# EasyEDA Pro project Access Control Passive Splitter.eprj

# Schematic Schematic1
Board Name: Board1; Create Date: 2026-01-26; Page Name: P1; Project Name: Access Control Passive Splitter; Schematic Name: Schematic1; Update Date: 2026-01-26; Company: EasyEDA.com; Page Size: A4; Version: V1.0
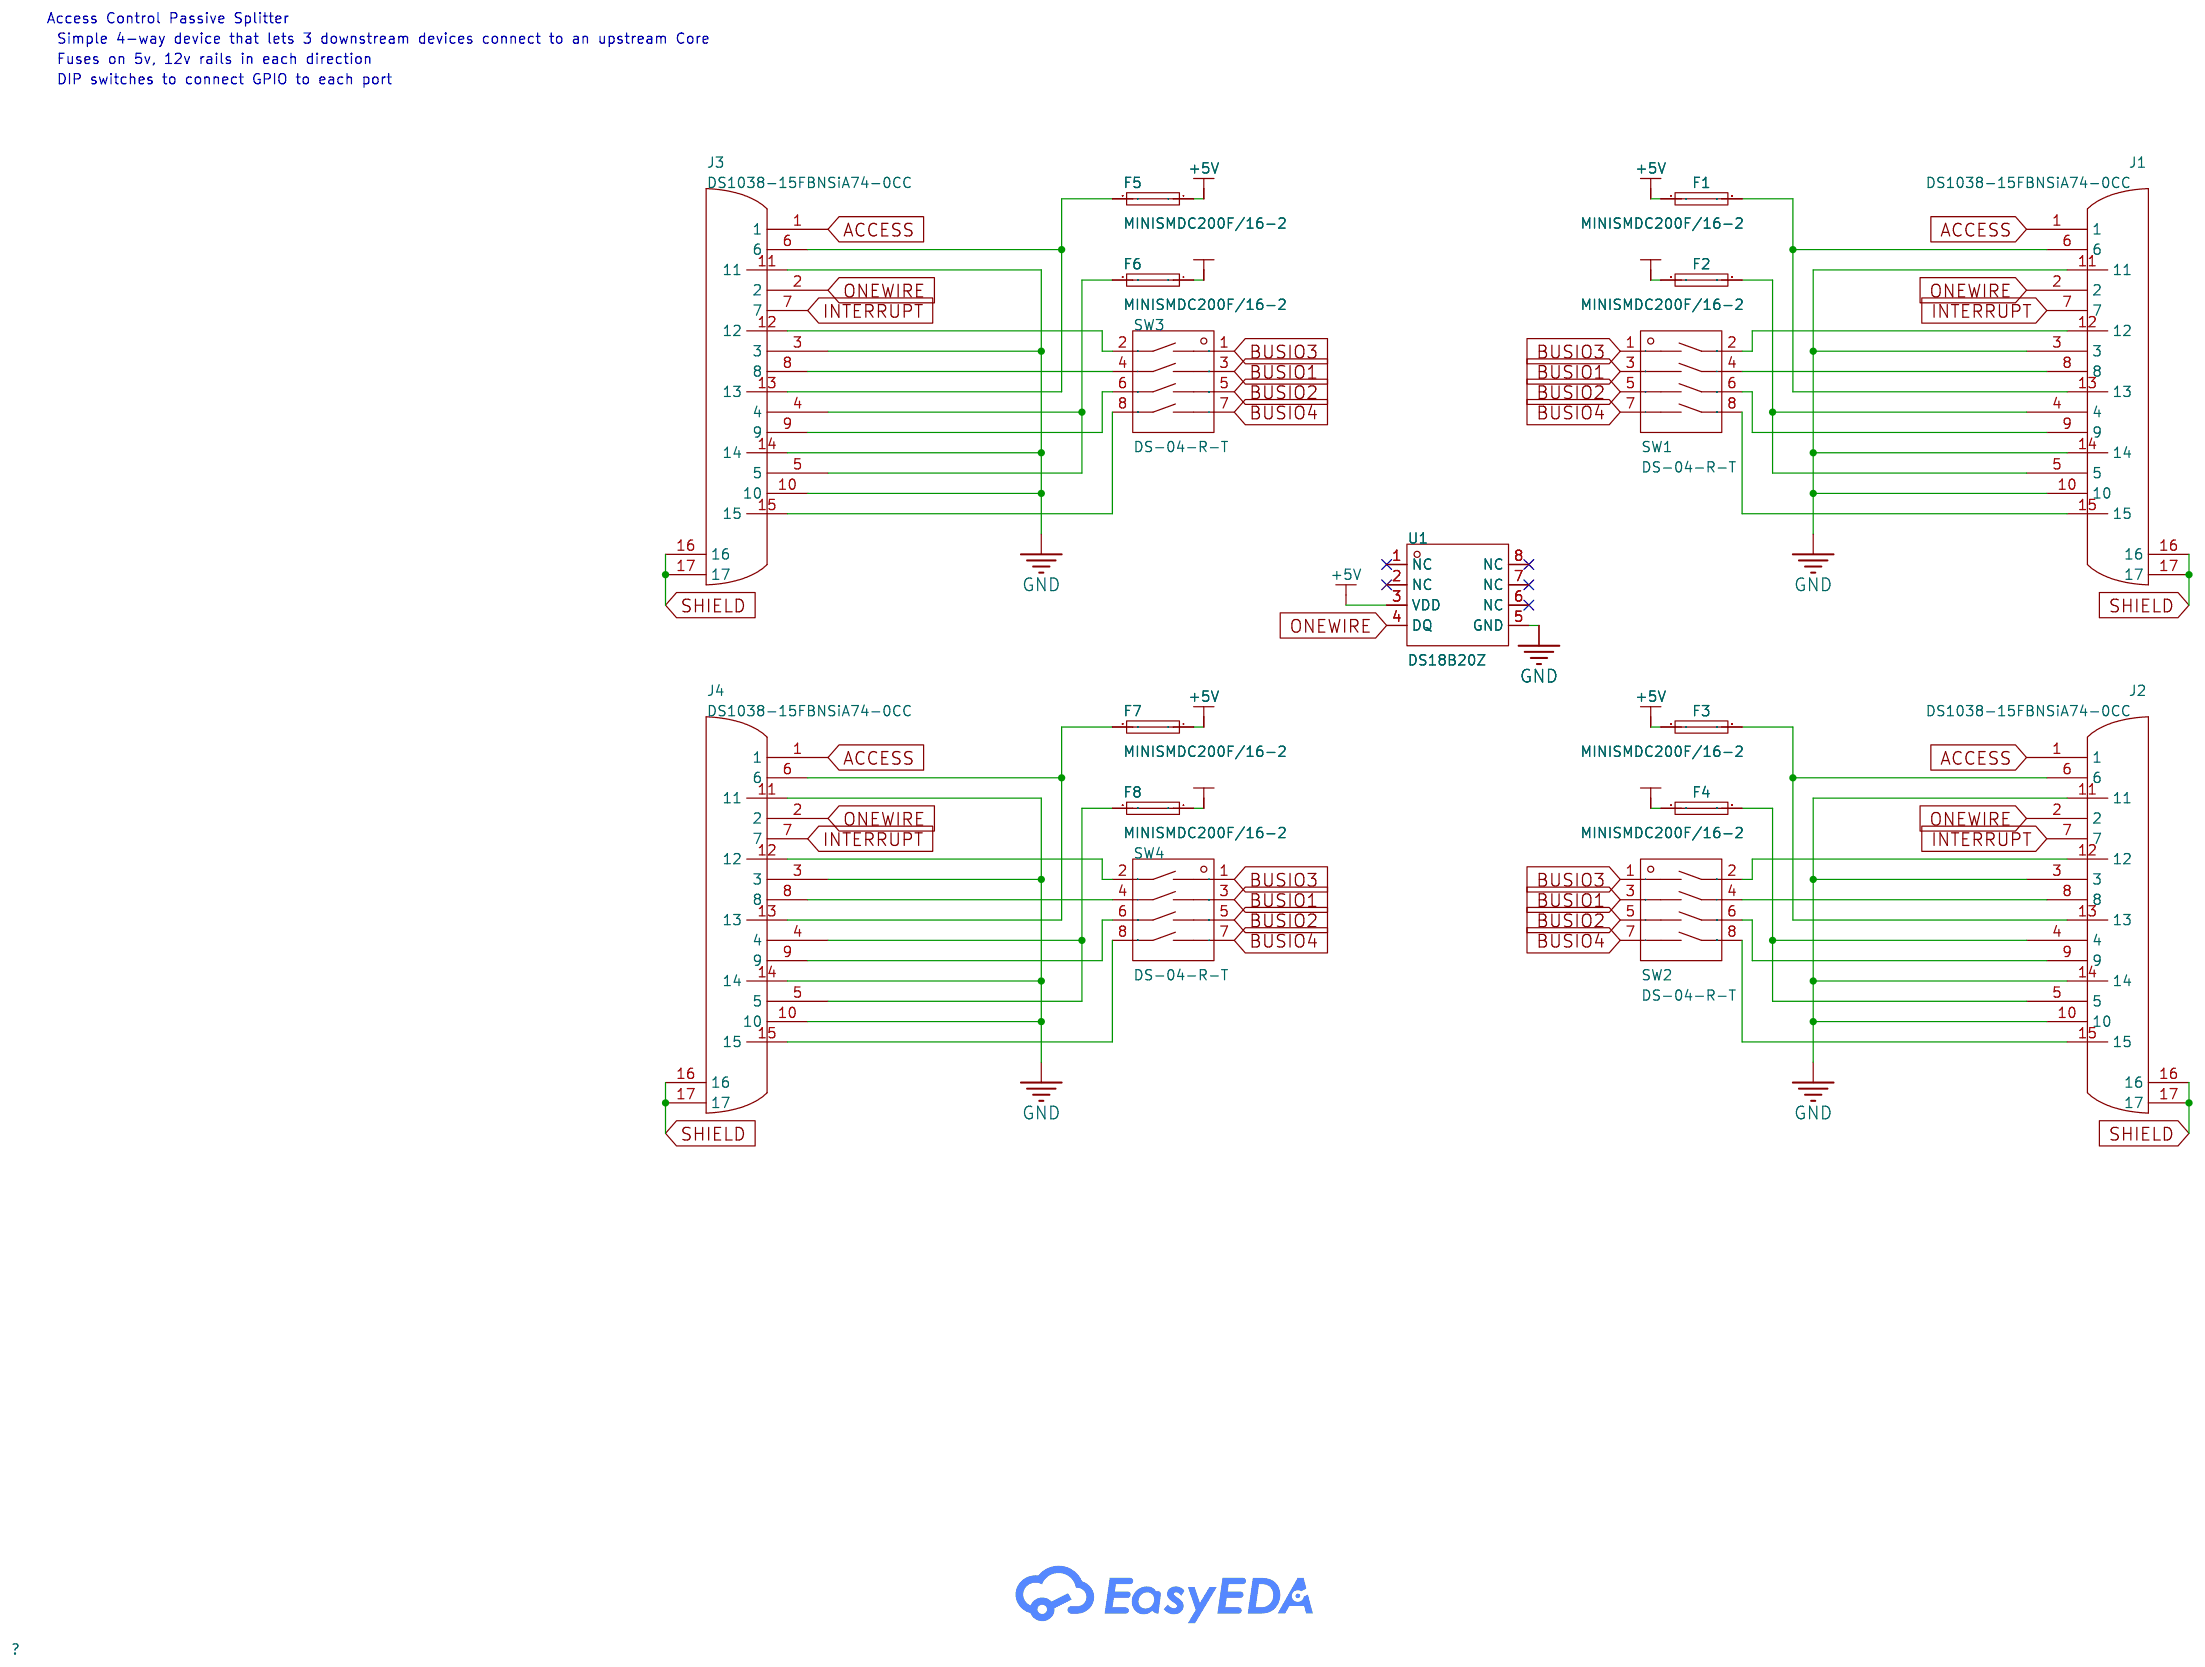
[diagram p0: schematic sheet]

## Parts
F1  MINISMDC200F/16-2  [R1812]
F2  MINISMDC200F/16-2  [R1812]
F3  MINISMDC200F/16-2  [R1812]
F4  MINISMDC200F/16-2  [R1812]
F5  MINISMDC200F/16-2  [R1812]
F6  MINISMDC200F/16-2  [R1812]
F7  MINISMDC200F/16-2  [R1812]
F8  MINISMDC200F/16-2  [R1812]
J1  DS1038-15FBNSiA74-0CC  [DSUB-TH_DS1038-15FBNSIA74-0CC]
J2  DS1038-15FBNSiA74-0CC  [DSUB-TH_DS1038-15FBNSIA74-0CC]
J3  DS1038-15FBNSiA74-0CC  [DSUB-TH_DS1038-15FBNSIA74-0CC]
J4  DS1038-15FBNSiA74-0CC  [DSUB-TH_DS1038-15FBNSIA74-0CC]
SW1  DS-04-R-T  [SW-TH_8P-L11.6-W9.9-P2.54_WT11-DS-04RR]
SW2  DS-04-R-T  [SW-TH_8P-L11.6-W9.9-P2.54_WT11-DS-04RR]
SW3  DS-04-R-T  [SW-TH_8P-L11.6-W9.9-P2.54_WT11-DS-04RR]
SW4  DS-04-R-T  [SW-TH_8P-L11.6-W9.9-P2.54_WT11-DS-04RR]
U1  DS18B20Z  [SOP-8_L4.9-W3.9-P1.27-LS6.0-BL]

## Library data of the parts
F1-F8 = MINISMDC200F/16-2: LCSC Part Name: 16V 2A; Supplier Part: C315963; Manufacturer: Littelfuse(美国力特); Supplier Footprint: 1812; Datasheet: https://item.szlcsc.com/datasheet/MINISMDC200F%252F16-2/297598.html; Supplier: LCSC; Voltage - Max: 16V; Hold Current: 2A; Power Dissipation: 1W; Resistance - Initial (Ri) (Min): 20mΩ; Resistance - Post Trip (R1) (Max): 72mΩ; Operating Temperature: -40℃~+85℃; Length: 5.4mm; Width: 3.2mm
J1-J4 = DS1038-15FBNSiA74-0CC: Connector Type:High Density D-Sub Gender:Female Number of Pins:15P Mounting Type:Right Angle Number of Rows:3 Current Rating-Signal:3A Current Rating-Power:- Voltage Rating:- Color:Black Operating Temperature:-40℃~+105℃ Operating Temperature:-40℃~+105℃; LCSC Part Name: 黑色 1000/盒 D-Sub 母 P数:15P; Supplier Part: C75754; Manufacturer: CONNFLY; Supplier Footprint: 弯插; JLCPCB Part Class: Extended Part; Datasheet: https://item.szlcsc.com/datasheet/DS1038-15FBNSiA74-0CC/76880.html; Supplier: LCSC; Connector Type: High Density D-Sub; Gender: Female; Number of Pins: 15P; Mounting Type: Right Angle; Number of Rows: 3; Current Rating-Signal: 3A; Color: Black; Operating Temperature: -40℃~+105℃
SW1-SW4 = DS-04-R-T: LCSC Part Name: 4位 2.54mm间距 宽体 拨码开关; Supplier Part: C5123702; Manufacturer: 康深; Supplier Footprint: 插件; JLCPCB Part Class: Extended Part; Datasheet: https://item.szlcsc.com/datasheet/DS-04-R-T/5718048.html; Supplier: LCSC; Circuit: SPST; Number of Positions: 4; Lead Pitch: 2.54mm; Current Rating: 25mA; Voltage Rating: 24V; Operating Temperature: -30℃~+85℃; Operating Life: 3,000 Cycles; Color: Red
U1 = DS18B20Z: Resolution:±0.4℃ Resolution:±0.4℃ Supply Voltage:2.5V~5.5V Supply Voltage:2.5V~5.5V; LCSC Part Name: 温度传感器; Supplier Part: C695837; Manufacturer: UMW(友台半导体); Supplier Footprint: SOIC-8; JLCPCB Part Class: Extended Part; Datasheet: https://atta.szlcsc.com/upload/public/pdf/source/20231109/DC3DA9D47D486EF40A6E0F08B9A498E3.pdf; Supplier: LCSC; Resolution: ±0.4℃; Supply Voltage: 2.5V~5.5V

## Nets
+5V: F1.1 F3.1 F5.1 F7.1 U1.3(VDD)
+12V: F2.1 F4.1 F6.1 F8.1
GND: J1.3 J1.10 J1.11 J1.14 J2.3 J2.10 J2.11 J2.14 J3.3 J3.10 J3.11 J3.14 J4.3 J4.10 J4.11 J4.14 U1.5(GND)
ACCESS: J1.1 J2.1 J3.1 J4.1
BUSIO1: SW1.3 SW2.3 SW3.3 SW4.3
BUSIO2: SW1.5 SW2.5 SW3.5 SW4.5
BUSIO3: SW1.1 SW2.1 SW3.1 SW4.1
BUSIO4: SW1.7 SW2.7 SW3.7 SW4.7
INTERRUPT: J1.7 J2.7 J3.7 J4.7
ONEWIRE: J1.2 J2.2 J3.2 J4.2 U1.4(DQ)
SHIELD: J1.16 J1.17 J2.16 J2.17 J3.16 J3.17 J4.16 J4.17
$1N316: F1.2 J1.6 J1.13
$1N317: F2.2 J1.4 J1.5
$1N319: J1.8 SW1.4
$1N321: J1.12 SW1.2
$1N323: J1.15 SW1.8
$1N324: J1.9 SW1.6
$1N1028: F3.2 J2.6 J2.13
$1N1031: J2.8 SW2.4
$1N1037: J2.9 SW2.6
$1N1041: F4.2 J2.4 J2.5
$1N1047: J2.15 SW2.8
$1N1061: J2.12 SW2.2
$1N1760: F7.2 J4.6 J4.13
$1N1766: F5.2 J3.6 J3.13
$1N1771: J3.15 SW3.8
$1N1774: J3.12 SW3.2
$1N1778: J3.8 SW3.4
$1N1780: F6.2 J3.4 J3.5
$1N1788: J3.9 SW3.6
$1N1807: F8.2 J4.4 J4.5
$1N1814: J4.9 SW4.6
$1N1818: J4.12 SW4.2
$1N1825: J4.15 SW4.8
$1N1828: J4.8 SW4.4

Not connected (* = marked no-connect by the designer): U1 1(NC)* 2(NC)* 6(NC)* 7(NC)* 8(NC)*

## Notes on the sheet
- Access Control Passive Splitter
- Simple 4-way device that lets 3 downstream devices connect to an upstream Core
- Fuses on 5v, 12v rails in each direction
- DIP switches to connect GPIO to each port

# Board PCB1
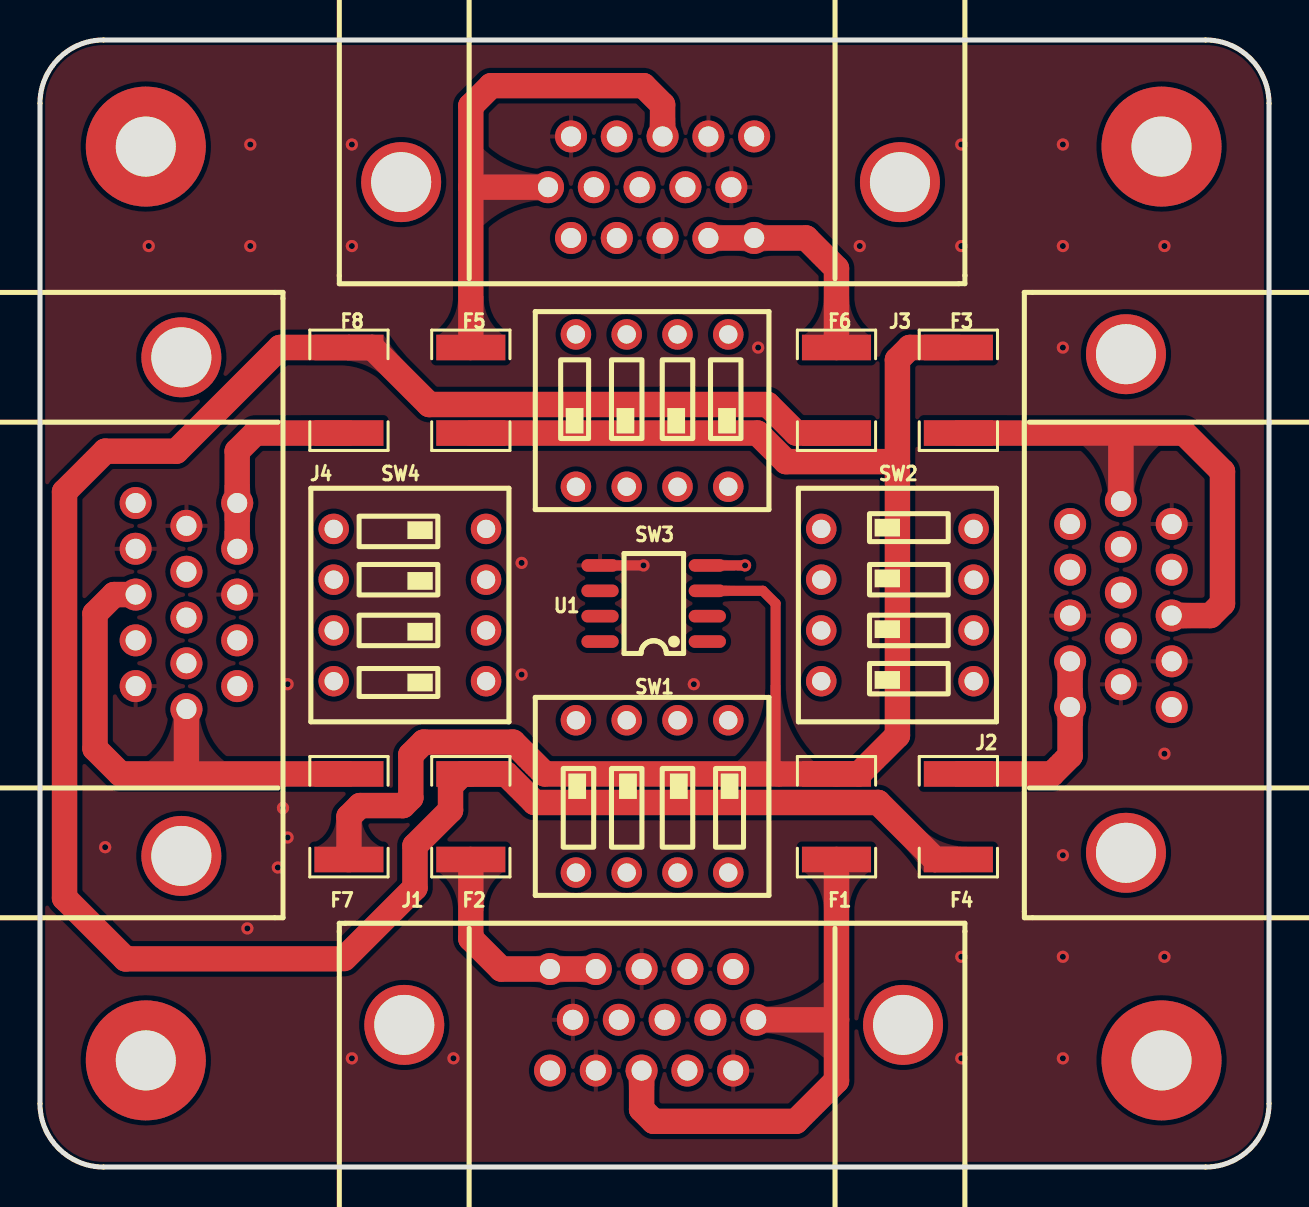
[diagram p1: board, top side]
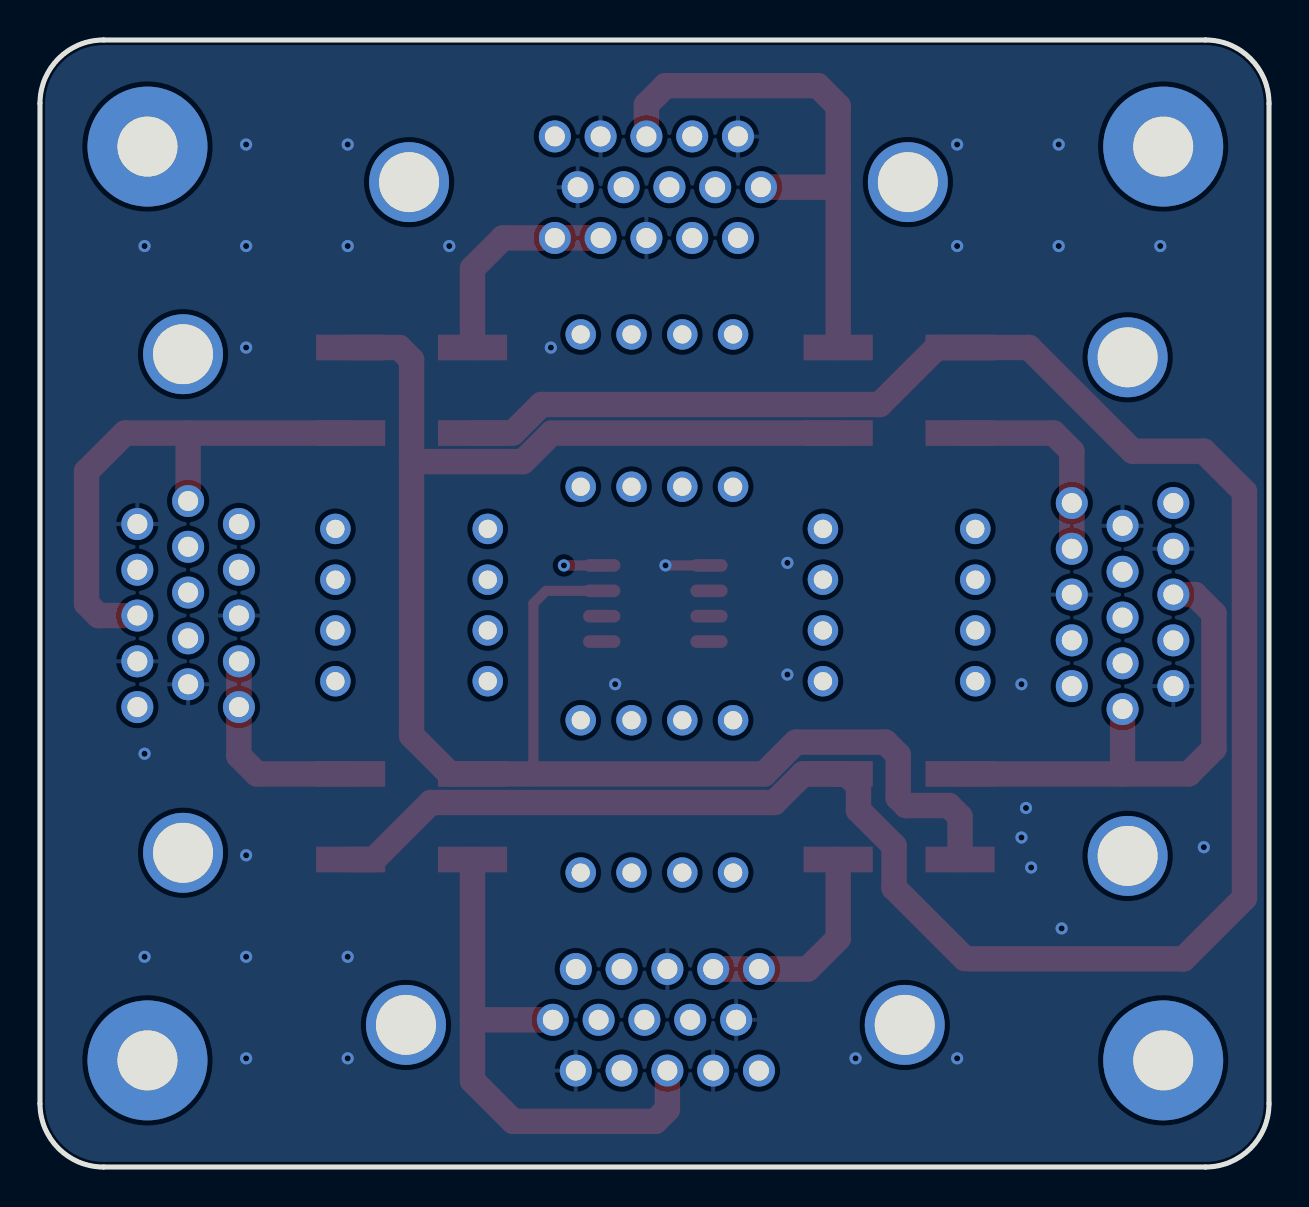
[diagram p2: board, bottom side, seen from below]

Outline 61.47 x 56.39 mm; copper layers: Top Layer, Inner1, Inner2, Bottom Layer. Coordinates in mm from the lower left corner of the outline.
Outline path: 0,53.21 0,3.17 arc(0.93,0.93) 3.17,0 58.29,0 arc(60.54,0.93) 61.47,3.17 61.47,53.21 arc(60.54,55.46) 58.29,56.39 3.17,56.39 arc(0.93,55.46) 0,53.21
Stack: Top Layer 0.035mm Outer layer thickness 1oz / Dielectric1 0.2104mm 7628 RC49% 8.6mil / Inner1 0.0152mm Inner layer thickness / Dielectric2 1.065mm 1.1mm H/HOZ Copper / Inner2 0.0152mm Inner layer thickness / Dielectric3 0.2104mm 7628 RC49% 8.6mil / Bottom Layer 0.035mm Outer layer thickness 1oz

## Design rules (mm)
template: JLCPCB Capability(Two Layers Board)
spacing copperThickness1oz (default): track to track 0.102, other pairs 0.152 to 0.3
spacing copperThickness2oz: track to track 0.203, other pairs 0.152 to 0.3
track width copperThickness1oz (default): min 0.127, default 0.254, max 2.54
track width copperThickness2oz: min 0.203, default 0.254, max 2.54
differential pair differentialPair (default): width min 0.127, default 0.254, max 2.54; gap min 0.152, default 0.152
via viaSize (default): diameter min 0.5, default 0.61, max 10; hole min 0.3, default 0.305, max 6.3

## Placement (name value [footprint] x y rotation side)
F1  MINISMDC200F/16-2  [R1812]  39.84 17.53 270 top
F2  MINISMDC200F/16-2  [R1812]  21.55 17.53 270 top
F3  MINISMDC200F/16-2  [R1812]  45.93 38.86 270 top
F4  MINISMDC200F/16-2  [R1812]  45.93 17.53 90 top
F5  MINISMDC200F/16-2  [R1812]  21.55 38.86 90 top
F6  MINISMDC200F/16-2  [R1812]  39.84 38.86 90 top
F7  MINISMDC200F/16-2  [R1812]  15.45 17.53 90 top
F8  MINISMDC200F/16-2  [R1812]  15.45 38.86 270 top
J1  DS1038-15FBNSiA74-0CC  [DSUB-TH_DS1038-15FBNSIA74-0CC]  30.69 7.37 0 top
J2  DS1038-15FBNSiA74-0CC  [DSUB-TH_DS1038-15FBNSIA74-0CC]  54.06 28.19 90 top
J3  DS1038-15FBNSiA74-0CC  [DSUB-TH_DS1038-15FBNSIA74-0CC]  30.54 49.02 180 top
J4  DS1038-15FBNSiA74-0CC  [DSUB-TH_DS1038-15FBNSIA74-0CC]  7.32 28.04 270 top
NOREF  -  [Pad_e30]  5.29 51.05 0 top
NOREF#2  -  [Pad_e33]  56.09 5.33 0 top
NOREF#3  -  [Pad_e32]  5.29 5.33 0 top
NOREF#4  -  [Pad_e34]  56.09 51.05 0 top
SW1  DS-04-R-T  [SW-TH_8P-L11.6-W9.9-P2.54_WT11-DS-04RR]  30.61 18.54 180 top
SW2  DS-04-R-T  [SW-TH_8P-L11.6-W9.9-P2.54_WT11-DS-04RR]  42.88 28.12 270 top
SW3  DS-04-R-T  [SW-TH_8P-L11.6-W9.9-P2.54_WT11-DS-04RR]  30.61 37.85 0 top
SW4  DS-04-R-T  [SW-TH_8P-L11.6-W9.9-P2.54_WT11-DS-04RR]  18.5 28.12 90 top
U1  DS18B20Z  [SOP-8_L4.9-W3.9-P1.27-LS6.0-BL]  30.69 28.19 90 top

## Footprints (pads in the part's own frame, mm; a bottom-side part is the same pattern mirrored in y, then rotated)
DSUB-TH_DS1038-15FBNSIA74-0CC
  round 1.6 hole 1: 1(3.978,2.54) 2(1.688,2.54) 3(-0.603,2.54) 4(-2.893,2.54) 5(-5.182,2.54) 6(5.128,0) 7(2.837,0) 8(0.548,0) 9(-1.743,0) 10(-4.042,0) 11(3.978,-2.54) 12(1.688,-2.54) 13(-0.603,-2.54) 14(-2.893,-2.54) 15(-5.182,-2.54)
  round 4 hole 3: 16(12.473,-0.254) 17(-12.473,-0.254)
Pad_e30
  round 6 hole 3: 1(0,0)
Pad_e32
  round 6 hole 3: 1(0,0)
Pad_e33
  round 6 hole 3: 1(0,0)
Pad_e34
  round 6 hole 3: 1(0,0)
R1812
  rect 1.282x3.456 smd: 1(-2.141,0) 2(2.141,0)
SOP-8_L4.9-W3.9-P1.27-LS6.0-BL
  oval 0.63x1.865 smd: 1(-1.905,-2.683) 2(-0.635,-2.683) 3(0.635,-2.683) 4(1.905,-2.683) 5(1.905,2.683) 6(0.635,2.683) 7(-0.635,2.683) 8(-1.905,2.683)
SW-TH_8P-L11.6-W9.9-P2.54_WT11-DS-04RR
  round 1.524 hole 0.914: 1(-3.81,-3.81) 2(-3.81,3.81) 3(-1.27,-3.81) 4(-1.27,3.81) 5(1.27,-3.81) 6(1.27,3.81) 7(3.81,-3.81) 8(3.81,3.81)

## Nets
As in the schematic.

Pads without a net: NOREF 1; NOREF#2 1; NOREF#3 1; NOREF#4 1; U1 1 2 6 7 8

## Via types
v1: diameter 0.61, hole 0.305, Top Layer to Bottom Layer, 33 vias

## Routing (per net, layer and track width the routed paths; a pad name or vN(x,y) marks a point on that pad's centre or on a via; arc(x,y) is an arc through that point)
+5V: length 90.1
  Top Layer w0.508: 36.95,19.67 36.79,19.83 36.79,28.19 36.15,28.83 U1.3
  Top Layer w1.27: F5.1 35.88,36.72 37.31,35.29 42.88,35.29 ; 42.88,35.29 42.88,40.39 43.5,41 45.93,41 ; 42.88,35.29 42.88,21.59 40.96,19.67 25.25,19.67 23.66,21.26 19.18,21.26 18.55,20.62 18.55,18.48 18.15,18.08 16.01,18.08 15.45,17.53 F7.1
+12V: length 116.9
  Top Layer w1.27: 15.21,10.43 18.75,13.97 18.75,16.07 20.53,17.85 20.53,19.07 21.12,19.67 23.31,19.67 24.74,18.24 41.92,18.24 44.77,15.38 F4.1 ; F6.1 37.82,36.72 36.39,38.15 19.47,38.15 16.61,41 12,41 6.82,35.81 3.26,35.81 1.23,33.78 1.23,13.46 4.28,10.41 14.94,10.41
GND: length 2.2
  Top Layer w0.508: U1.5 v1(30.18,30.1)
  vias: v1(3.26,16) v1(5.44,46.08) v1(10.37,11.94) v1(10.52,51.16) v1(10.52,46.08) v1(11.9,14.99) v1(12.15,17.96) v1(12.38,24.16) v1(12.38,16.49) v1(15.6,51.16) v1(15.6,46.08) v1(15.6,5.44) v1(20.68,5.44) v1(24.09,30.23) v1(24.09,24.64) v1(32.7,24.16) v1(35.92,41) v1(41,46.08) v1(46.08,51.16) v1(46.08,46.08) v1(46.08,10.52) v1(46.08,5.44) v1(51.16,51.16) v1(51.16,46.08) v1(51.16,41) v1(51.16,15.6) v1(51.16,10.52) v1(51.16,5.44) v1(56.24,46.08) v1(56.24,20.68) v1(56.24,10.52)
ACCESS: length 97.8
  Inner2 w0.381: 25.05,38.86 25.1,38.92 25.1,45.03 J3.1 ; 25.05,38.86 39.33,38.86 44.41,33.78 49.91,33.78 J2.1 ; 25.05,38.86 20.53,38.86 17.99,36.32 17.99,22.1 ; 17.99,22.1 11.83,22.1 J4.1 ; 17.99,22.1 22.56,17.53 35.77,17.53 37.3,16 37.3,12.53 J1.1
BUSIO1: length 33.5
  Inner2 w0.508: 25.1,26.84 25.1,25.65 26.12,24.64 29.6,24.64 SW1.3 ; 25.1,26.84 25.1,26.85 SW4.3 ; 25.1,26.84 25.1,30.48 26.63,32 36.46,32 SW2.3 ; SW3.3 29.34,32.01
BUSIO2: length 54.5
  Inner1 w0.508: 31.92,35.81 31.88,35.78 SW3.5 ; 31.92,35.81 39.33,35.81 41.36,33.78 41.36,29.13 SW2.5 ; 31.92,35.81 22.56,35.81 20.53,33.78 20.53,29.39 ; SW1.5 28.07,21.08 23.07,21.08 20.53,23.62 20.53,29.39 ; 20.53,29.39 SW4.5
BUSIO3: length 47.7
  Inner2 w0.508: SW1.1 32.9,20.83 25.79,20.83 SW4.1 20.36,24.31 20.02,24.64 20.02,32.77 21.29,34.04 SW3.1 28.33,35.56 37.55,35.56 39.07,34.04 SW2.1
BUSIO4: length 35.7
  Inner1 w0.508: SW1.7 25.1,24.05 25.1,31.93 ; 25.1,31.93 SW4.7 ; 25.1,31.93 34.51,31.93 ; 34.51,31.93 34.51,33.95 SW3.7 ; 34.51,31.93 35.8,31.93 36.79,30.94 36.79,25.15 37.63,24.31 SW2.7
INTERRUPT: length 160.1
  Inner2 w0.381: 2.24,25.18 2.24,40.89 15.45,54.1 27.74,54.1 ; 2.24,25.18 2.24,14.48 14.84,1.88 32.32,1.88 33.53,3.09 33.53,4.35 33.53,4.35 33.53,5.3 33.53,5.3 J1.7 ; 2.24,25.18 2.27,25.2 7.32,25.2 J4.7 ; 27.74,54.1 45.42,54.1 59.65,39.88 59.65,32.77 57.91,31.03 54.06,31.03 J2.7 ; 27.74,54.1 27.7,54.06 27.7,52.04 27.7,52.03 27.7,51.09 27.7,51.09 J3.7
ONEWIRE: length 116.8
  Top Layer w0.508: U1.4 v1(35.26,30.1)
  Inner1 w0.508: v1(35.26,30.1) 36.18,29.18 36.18,22.61 ; 48.98,29.88 48.98,24.13 47.46,22.61 36.18,22.61 ; 48.98,29.88 J2.2 ; 48.98,29.88 48.98,42.42 46.95,44.45 28.79,44.45 ; 28.79,44.45 28.85,44.51 J3.2 ; 28.79,44.45 14.44,44.45 12.4,42.42 12.4,28.89 J4.2 ; 36.18,22.61 36.18,13.87 35.01,12.7 33.23,12.7 32.38,11.85 J1.2
SHIELD: length 158.8
  Inner1 w0.508: J1.17 10.12,7.11 7.07,10.16 J4.16 2.75,19.88 2.75,36.19 J4.17 7.07,46.23 10.37,49.53 17.81,49.53 J3.16 22.89,54.1 38.18,54.1 J3.17 51.27,49.28 54.31,46.23 J2.16 59.14,35.84 59.14,20.55 J2.17 54.31,9.65 51.77,7.11 43.16,7.11
$1N316: length 27.9
  Top Layer w1.27: 39.84,7.37 J1.6 ; 39.84,7.37 F1.2 ; 39.84,7.37 39.84,4.32 37.8,2.29 30.69,2.29 30.09,2.89 J1.13
$1N317: length 10.8
  Top Layer w1.27: J1.4 J1.5 23.07,9.91 21.55,11.43 F2.2
$1N319: length 7.6
  Inner2 w0.381: SW1.4 31.24,14.09 31.24,7.37 J1.8
$1N321: length 10.8
  Inner2 w0.381: SW1.2 33.52,13.83 33.52,9.18 32.38,8.04 32.38,6.89 32.38,6.89 J1.12
$1N323: length 11.6
  Inner2 w0.381: SW1.8 24.09,12.02 24.09,6.25 J1.15
$1N324: length 7.5
  Inner2 w0.381: J1.9 28.95,9.43 28.95,9.43 28.95,10.38 28.95,10.38 28.95,14.34 SW1.6
$1N1028: length 26.8
  Top Layer w1.27: F3.2 54.06,36.72 ; 54.06,36.72 J2.6 ; 54.06,36.72 57.22,36.72 59.14,34.8 59.14,28.19 58.54,27.59 J2.13
$1N1031: length 7.6
  Inner2 w0.381: J2.8 51.99,28.74 51.99,28.74 51.05,28.74 51.04,28.74 47.34,28.74 SW2.4
$1N1037: length 7.5
  Inner2 w0.381: J2.9 51.99,26.45 51.99,26.45 47.09,26.45 SW2.6
$1N1041: length 10.7
  Top Layer w1.27: 45.93,19.67 50.61,19.67 51.52,20.57 J2.5 J2.4
$1N1047: length 12
  Inner2 w0.381: SW2.8 49.92,21.08 54.67,21.08 J2.15
$1N1061: length 10.8
  Inner2 w0.381: SW2.2 47.59,31.03 52.24,31.03 53.38,29.88 54.53,29.88 54.54,29.88 J2.12
$1N1760: length 25.6
  Top Layer w1.27: 15.45,19.67 7.32,19.67 ; 7.32,19.67 J4.6 ; 7.32,19.67 4.02,19.67 2.75,20.94 2.75,27.69 3.71,28.64 4.78,28.64
$1N1766: length 27.9
  Top Layer w1.27: 21.55,49.02 21.55,53.09 22.56,54.1 30.18,54.1 31.14,53.15 J3.13 ; 21.55,49.02 J3.6 ; 21.55,49.02 21.55,41
$1N1771: length 11.7
  Inner2 w0.381: J3.15 37.3,49.98 37.3,44.53 SW3.8
$1N1774: length 10.8
  Inner2 w0.381: J3.12 28.85,49.5 28.85,49.49 28.85,48.55 28.85,48.55 28.85,48.19 27.7,47.05 27.7,42.55 SW3.2
$1N1778: length 7.6
  Inner2 w0.381: J3.8 29.99,46.96 29.99,46.95 29.99,46.01 29.99,46.01 29.99,42.3 SW3.4
$1N1780: length 11
  Top Layer w1.27: 39.84,41 39.84,44.96 38.31,46.48 J3.5 J3.4
$1N1788: length 7.5
  Inner2 w0.381: J3.9 32.28,46.96 32.28,46.95 32.28,42.05 SW3.6
$1N1807: length 10.8
  Top Layer w1.27: J4.4 J4.5 9.86,35.81 10.77,36.72 F8.2
$1N1814: length 7.5
  Inner2 w0.381: J4.9 9.39,29.78 9.39,29.78 10.34,29.78 10.34,29.78 14.29,29.78 SW4.6
$1N1818: length 10.8
  Inner2 w0.381: J4.12 6.85,26.35 6.85,26.35 7.8,26.35 7.8,26.35 7.9,26.35 9.04,25.21 13.79,25.21 SW4.2
$1N1825: length 11.7
  Inner2 w0.381: J4.15 6.36,34.8 11.82,34.8 SW4.8
$1N1828: length 7.6
  Inner2 w0.381: SW4.4 14.05,27.49 10.34,27.49 10.34,27.49 9.39,27.49 9.39,27.49 J4.8

## Copper pours and planes (outline as drawn; the poured copper is in the pictures)
GND on Top Layer: -1.82,58.67 65.24,58.67 65.24,-3.81 -1.82,-3.81
GND on Bottom Layer: -1.82,59.69 63.2,59.69 63.2,-2.79 -1.82,-2.79
GND on Inner1: -0.8,58.67 62.7,58.67 62.7,-2.29 -0.8,-2.29
GND on Inner2: -1.82,58.17 63.2,58.17 63.2,-1.78 -1.82,-1.78

Small or netless copper shapes (teardrops, artwork), in the pictures only: 42 on Top Layer, 34 on Inner1, 56 on Inner2
